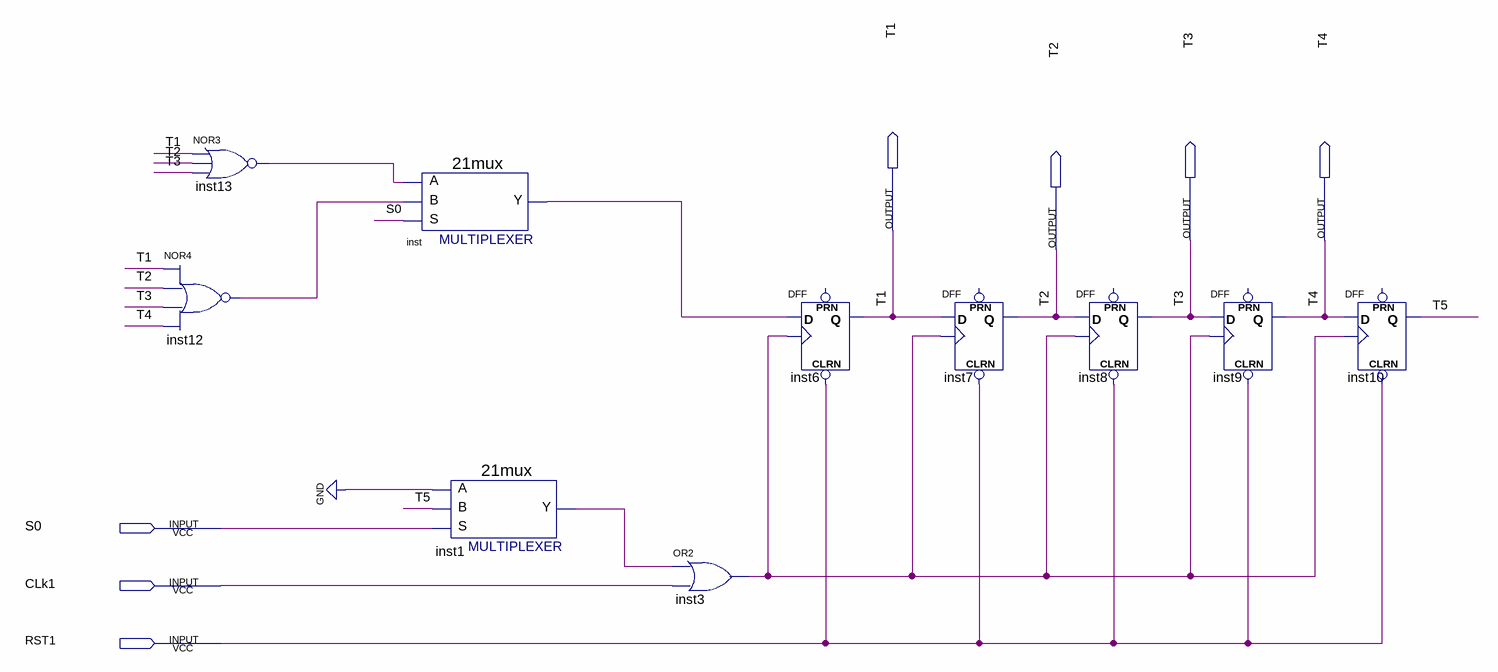
[diagram p0: schematic sheet]
// Quartus schematic Time.bdf as structural Verilog: 10 symbols, 7 pins
module Time (
  input  S0,
  input  CLk1,
  input  RST1,
  output T1,
  output T3,
  output T4,
  output T2
);

  wire inst1_y, inst3_out, inst12_out, inst13_out, inst_y, T5;

  nor inst12 (inst12_out, T1, T2, T3, T4);
  nor inst13 (inst13_out, T1, T2, T3);
  \21mux  inst (.S(S0), .B(inst12_out), .A(inst13_out), .Y(inst_y));
  \21mux  inst1 (.S(S0), .B(T5), .A(1'b0), .Y(inst1_y));
  or inst3 (inst3_out, inst1_y, CLk1);
  DFF inst6 (.CLRN(RST1), .CLK(inst3_out), .D(inst_y), .Q(T1));  // open: PRN
  DFF inst7 (.CLRN(RST1), .CLK(inst3_out), .D(T1), .Q(T2));  // open: PRN
  DFF inst8 (.CLRN(RST1), .CLK(inst3_out), .D(T2), .Q(T3));  // open: PRN
  DFF inst9 (.CLRN(RST1), .CLK(inst3_out), .D(T3), .Q(T4));  // open: PRN
  DFF inst10 (.CLRN(RST1), .CLK(inst3_out), .D(T4), .Q(T5));  // open: PRN
endmodule
